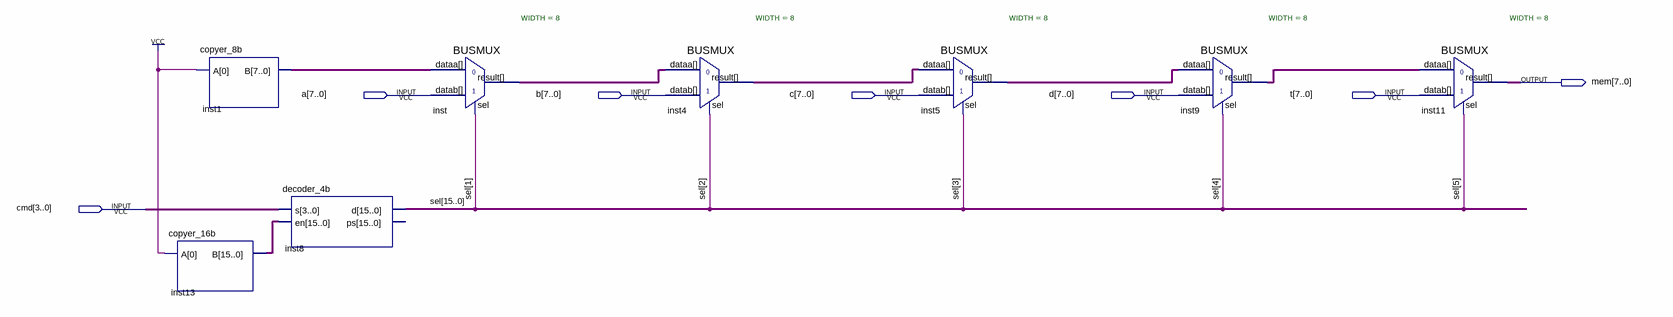
[diagram p0: schematic sheet]
// Quartus schematic mem_8bit.bdf as structural Verilog: 8 symbols, 7 pins
module mem_8bit (
  input  [7:0] a,
  input  [7:0] b,
  input  [7:0] c,
  input  [7:0] d,
  input  [7:0] t,
  input  [3:0] cmd,
  output [7:0] mem
);

  wire [7:0] inst1_b, inst4_result, inst5_result, inst9_result, inst_result;
  wire [15:0] inst13_b, sel;

  copyer_16b inst13 (.A(1'b1), .B(inst13_b));
  copyer_8b inst1 (.A(1'b1), .B(inst1_b));
  decoder_4b inst8 (.s(cmd), .en(inst13_b), .d(sel));  // open: ps
  BUSMUX #(.WIDTH(8)) inst (.datab(a), .sel(sel[1]), .dataa(inst1_b), .result(inst_result));
  BUSMUX #(.WIDTH(8)) inst4 (.datab(b), .sel(sel[2]), .dataa(inst_result), .result(inst4_result));
  BUSMUX #(.WIDTH(8)) inst5 (.datab(c), .sel(sel[3]), .dataa(inst4_result), .result(inst5_result));
  BUSMUX #(.WIDTH(8)) inst9 (.datab(d), .sel(sel[4]), .dataa(inst5_result), .result(inst9_result));
  BUSMUX #(.WIDTH(8)) inst11 (.datab(t), .sel(sel[5]), .dataa(inst9_result), .result(mem));
endmodule
